# Altium schematic sheet Sheet1.SchDoc
size A4; SheetNumber: 1; SheetTotal: 1
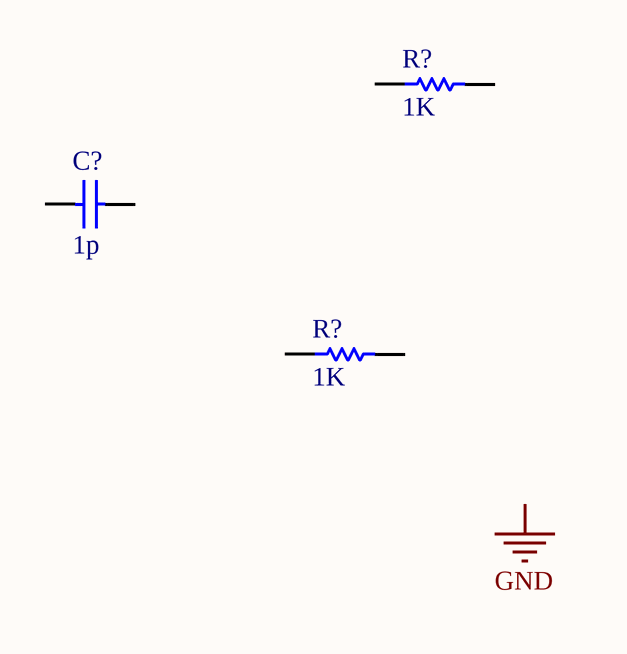
[diagram p0: Sheet1.SchDoc]

## Parts
(Parts that share a designator on the sheet are numbered #1, #2 ... from top to bottom, then left to right.)
C?  value 1p  (hidden comment: Capacitor)
R?#1  value 1K  (hidden comment: Resistor)
R?#2  value 1K  (hidden comment: Resistor)

## Nets

Not connected (* = marked no-connect by the designer): C? 1 2; R?#1 1 2; R?#2 1 2

## Notes on the sheet
- Labels drawn without touching a wire or pin: GND

## Library data of the parts
C? = Capacitor: SimulationGenericComponent: True
R?#1 R?#2 = Resistor: TC1: 0; SimulationGenericComponent: True; TC2: 0